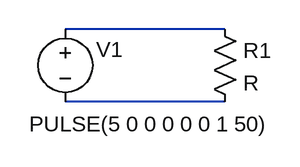
[diagram p0: schematic Testing_Square_Wave.asc]
Testing_Square_Wave.asc, the LTspice schematic file:
Version 4
SHEET 1 880 680
WIRE 288 128 112 128
WIRE 288 208 112 208
SYMBOL voltage 112 112 R0
WINDOW 0 34 39 Left 2
WINDOW 3 -40 121 Left 2
WINDOW 123 0 0 Left 0
WINDOW 39 0 0 Left 0
SYMATTR InstName V1
SYMATTR Value PULSE(5 0 0 0 0 0 1 50)
SYMBOL res 272 112 R0
SYMATTR InstName R1

The netlist it stands for:
* Testing_Square_Wave.asc
V1 N001 N002 PULSE(5 0 0 0 0 0 1 50)
R1 N001 N002 R
.backanno
.end